# Altium schematic sheet СФ МЭИ ЛБ ПЭ2-18 11.03.04 03 Э3.SchDoc
size 420 x 297 mm; Scale: 1:1; Разраб.: Гончаренко В.Ю.; Пров.: Смолин В.А.; Номер листа: 1; Общее количество листов: 1; Наименование изделия 1: Стабилизатор напряжения; Наименование изделия 2: Схема электрическая; Наименование изделия 3: принципиальная; Нач. отд.: Нач. отд.; Децимальный номер: СФ МЭИ ЛБ ПЭ2-18 11.03.04 03 Э3; Наименование. Строка 2: напряжения; Наименование. Строка 3: Схема электирическая принципиальная; Наименование. Строка 1: Стабилизатор; Разработал: Гончаренко В.Ю.; Проверил: Смолин В.А.; Утвердил: Рассказа Д.С.; Литера: У; Масштаб: 1:1; Лист. Номер: 1; Лист. Всего: 1
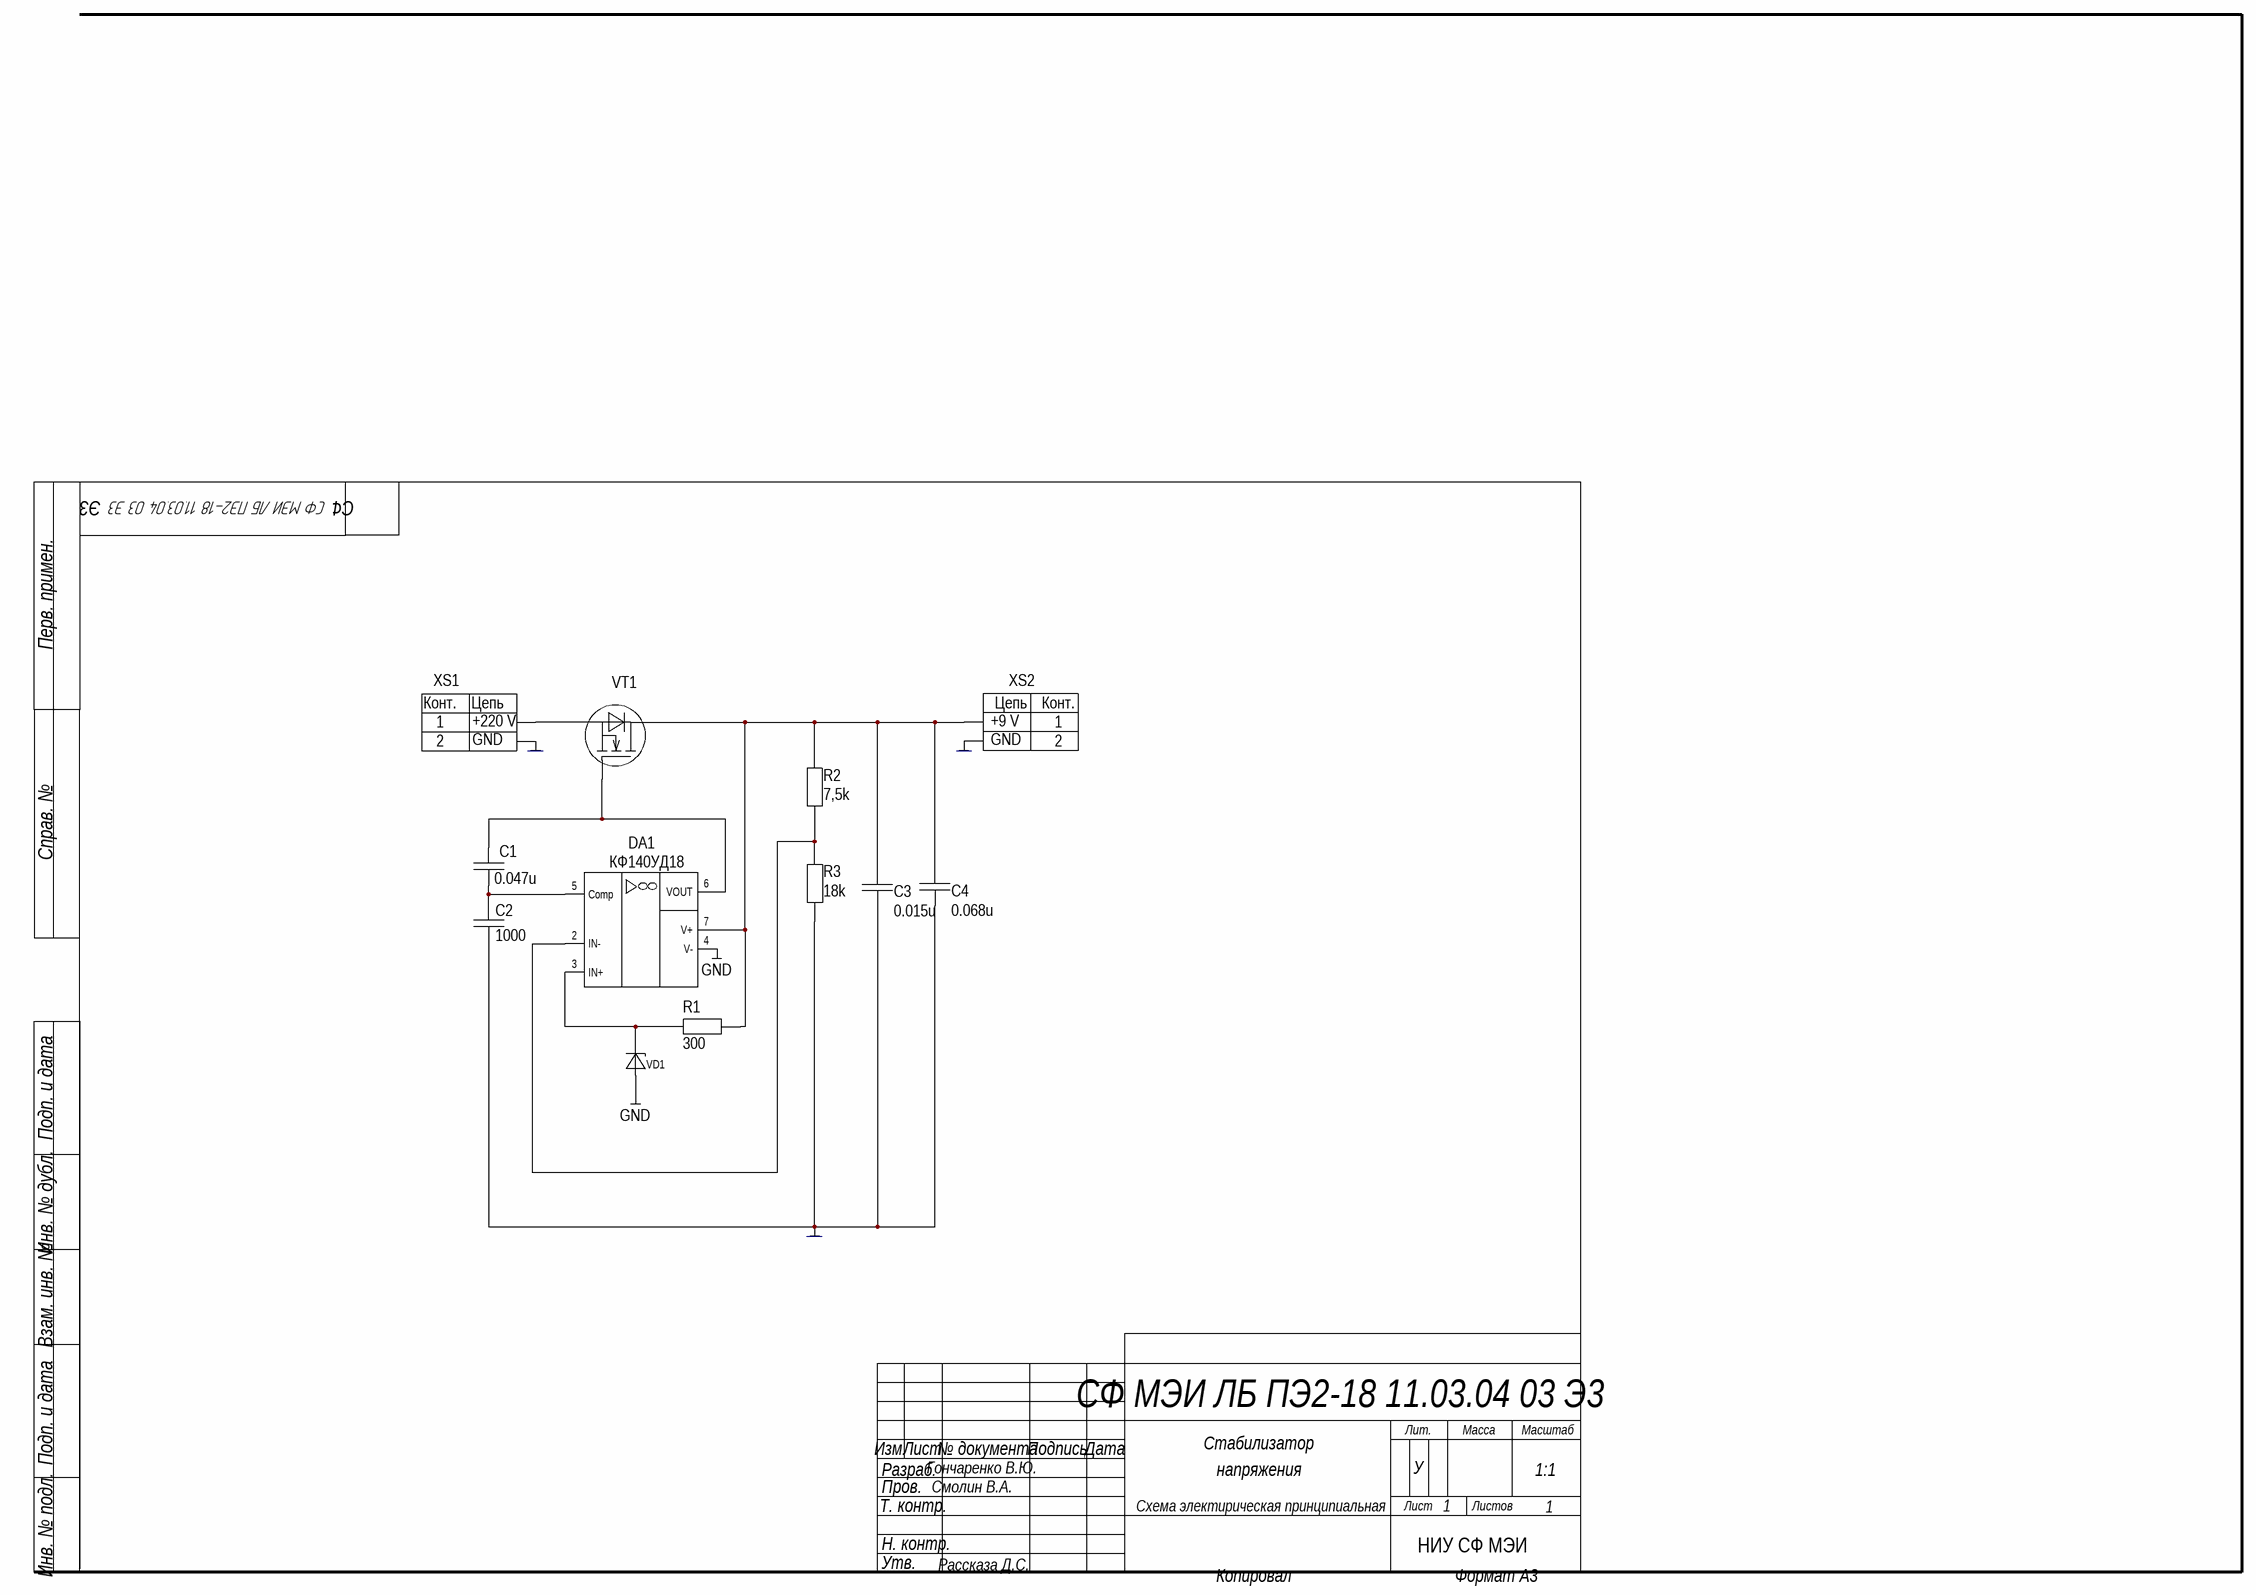
[diagram p0: СФ МЭИ ЛБ ПЭ2-18 11.03.04 03 Э3.SchDoc]

## Parts
C1  0.047u  [0805]
C2  1000  [0805]
C3  0.015u  [0805]
C4  0.068u  [0805]
DA1  КФ140УД18  [SOIC-8]
R1  300  [0805]
R2  7,5k  [0805]
R3  18k  [0805]
VD1  MMSZ5235B  [SOD-123]  (value not drawn)
VT1  IRLML2402TRPBF  [SOT23]  (value not drawn)
XS1  DG126-5.0-0.2P  [DG126-5.0-02P]  (value not drawn)
XS2  DG126-5.0-0.2P  [DG126-5.0-02P]  (value not drawn)

## Nets
GND: DA1.4(V-) VD1.1(In)
NetC2_1: C2.1 C3.2 C4.1 R3.1 XS1.2(Pin2) XS2.2(Pin2)
NetC1_1: C1.1 C2.2 DA1.5(Comp)
NetC1_2: C1.2 DA1.6(VOUT) VT1.1(G)
NetC3_1: C3.1 C4.2 DA1.7(V+) R1.2 R2.2 VT1.3(D) XS2.1(Pin1)
NetDA1_2: DA1.2(IN-) R2.1 R3.2
NetDA1_3: DA1.3(IN+) R1.1 VD1.2(Out)
NetVT1_2: VT1.2(S) XS1.1(Pin1)

## Notes on the sheet
- (near XS1) +220 V
- (near XS2) +9 V
- (near XS1) GND
- (near XS2) GND
- НИУ СФ МЭИ ПЭ2-18
- Перв. примен.
- Справ. №
- Подп. и дата
- Инв. № дубл.
- Взам. инв. №
- Разраб.
- Изм.
- Лист
- № документа
- Подпись
- Дата
- Лит.
- Масса
- Масштаб
- Т. контр.
- Пров.
- Листов
- Инв. № подл.
- Н. контр.
- Утв.
- Копировал
- Формат A3
- (in symbol DG126-5.0-0.2P) Конт.; Цепь

## Library data of the parts
C1 = К53-68"R"-25В-0.047 мкФ ±10% 0805_3: К53-68"R"-25В-0.047 мкФ ±10%
C2 = К53-68"R"-25В-1000 пФ ±10% 0805_2: К53-68"R"-25В-1000 пФ ±10%
C3 = К53-68"R"-25В-0.015 мкФ ±10% 0805_1: К53-68"R"-25В-0.015 мкФ ±10%
C4 = К53-68"R"-25В-0.068 мкФ ±10% 0805: К53-68"R"-25В-0.068 мкФ ±10%
R1 = 0.125Вт 0805 300 Ом, 5%, Чип резистор (SMD): 0805-0.125 Вт -300 Ом±5%
R2 = 0.125Вт 0805 7,5 кОм, 5%, Чип резистор (SMD): 0805-0.125 Вт -7,5 кОм±5%
R3 = 0.125Вт 0805 18 кОм, 5%, Чип резистор (SMD): 0805-0.125 Вт -18 кОм±5%
VT1 = IRLML2402TRPBF: SI2304DDS-T1-GE3